# Altium schematic sheet DC-DC.SchDoc
size A4
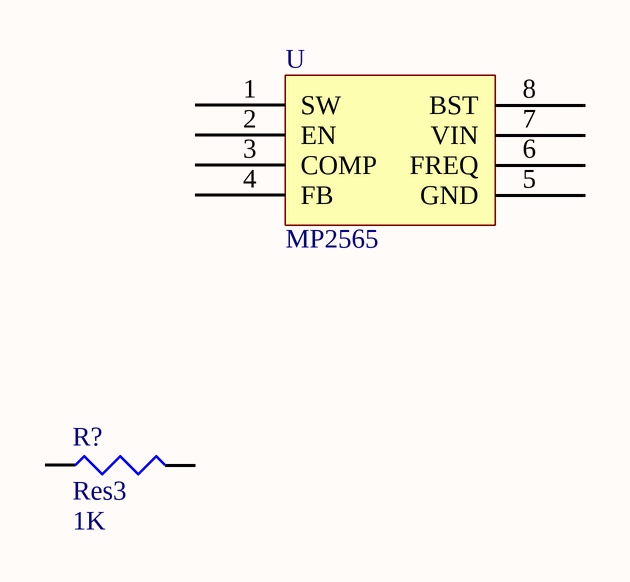
[diagram p0: DC-DC.SchDoc]

## Parts
R?  Res3  value 1K  [RESC6332]
U  MP2565  [SOIC8E]

## Nets

Not connected (* = marked no-connect by the designer): R? 1 2; U 1(SW) 2(EN) 3(COMP) 4(FB) 5(GND) 6(FREQ) 7(VIN) 8(BST)

## Library data of the parts
R? = Res3: Resistor; Published: 8-Jun-2000; LatestRevisionDate: 29-May-2009; LatestRevisionNote: IPC-7351 Footprint Added.; PackageReference: J1-0603; Publisher: Altium Limited; PackageDescription: Chip Resistor